# Altium project Project-C_VOLTAGE.PrjPCB (part 5 of 6)
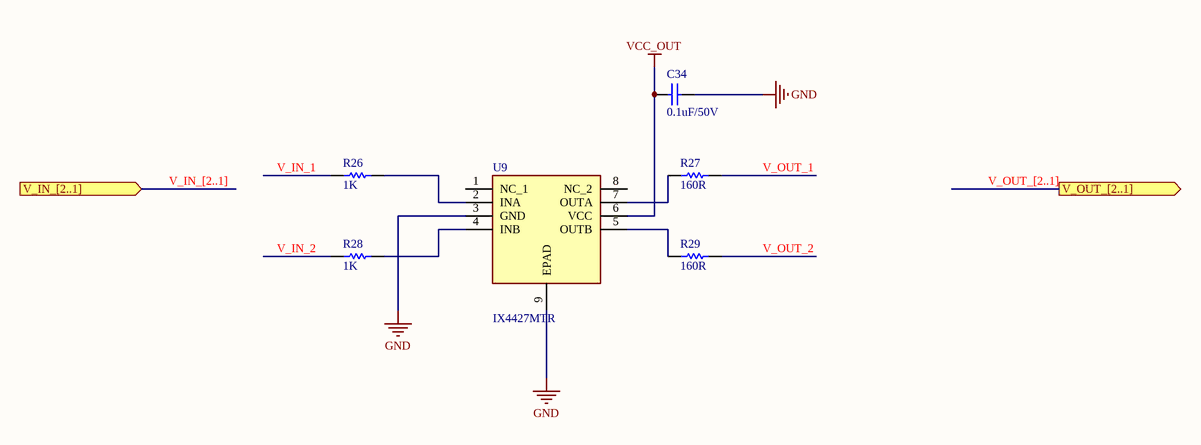
[diagram p12: VoltageAmplifier.SchDoc]

## Nets that join several sheets (continued)
GPIO_47: F3/IO (P1_F3_IO.41), U_VoltageAmplifier_1xFPGA3/U_VoltageAmplifier24 (R28_U_VoltageAmplifier_1xFPGA3_U_VoltageAmplifier24.1)
GPIO_47: F4/IO (P1_F4_IO.41), U_VoltageAmplifier_1xFPGA4/U_VoltageAmplifier24 (R28_U_VoltageAmplifier_1xFPGA4_U_VoltageAmplifier24.1)
GPIO_48: F1/IO (P1_F1_IO.43), U_VoltageAmplifier_1xFPGA1/U_VoltageAmplifier25 (R26_U_VoltageAmplifier_1xFPGA1_U_VoltageAmplifier25.1)
GPIO_48: F2/IO (P1_F2_IO.43), U_VoltageAmplifier_1xFPGA2/U_VoltageAmplifier25 (R26_U_VoltageAmplifier_1xFPGA2_U_VoltageAmplifier25.1)
GPIO_48: F3/IO (P1_F3_IO.43), U_VoltageAmplifier_1xFPGA3/U_VoltageAmplifier25 (R26_U_VoltageAmplifier_1xFPGA3_U_VoltageAmplifier25.1)
GPIO_48: F4/IO (P1_F4_IO.43), U_VoltageAmplifier_1xFPGA4/U_VoltageAmplifier25 (R26_U_VoltageAmplifier_1xFPGA4_U_VoltageAmplifier25.1)
GPIO_49: F1/IO (P1_F1_IO.44), U_VoltageAmplifier_1xFPGA1/U_VoltageAmplifier25 (R28_U_VoltageAmplifier_1xFPGA1_U_VoltageAmplifier25.1)
GPIO_49: F2/IO (P1_F2_IO.44), U_VoltageAmplifier_1xFPGA2/U_VoltageAmplifier25 (R28_U_VoltageAmplifier_1xFPGA2_U_VoltageAmplifier25.1)
GPIO_49: F3/IO (P1_F3_IO.44), U_VoltageAmplifier_1xFPGA3/U_VoltageAmplifier25 (R28_U_VoltageAmplifier_1xFPGA3_U_VoltageAmplifier25.1)
GPIO_49: F4/IO (P1_F4_IO.44), U_VoltageAmplifier_1xFPGA4/U_VoltageAmplifier25 (R28_U_VoltageAmplifier_1xFPGA4_U_VoltageAmplifier25.1)
GPIO_50: F1/IO (P1_F1_IO.52), U_VoltageAmplifier_1xFPGA1/U_VoltageAmplifier26 (R26_U_VoltageAmplifier_1xFPGA1_U_VoltageAmplifier26.1)
GPIO_50: F2/IO (P1_F2_IO.52), U_VoltageAmplifier_1xFPGA2/U_VoltageAmplifier26 (R26_U_VoltageAmplifier_1xFPGA2_U_VoltageAmplifier26.1)
GPIO_50: F3/IO (P1_F3_IO.52), U_VoltageAmplifier_1xFPGA3/U_VoltageAmplifier26 (R26_U_VoltageAmplifier_1xFPGA3_U_VoltageAmplifier26.1)
GPIO_50: F4/IO (P1_F4_IO.52), U_VoltageAmplifier_1xFPGA4/U_VoltageAmplifier26 (R26_U_VoltageAmplifier_1xFPGA4_U_VoltageAmplifier26.1)
GPIO_51: F1/IO (P1_F1_IO.46), U_VoltageAmplifier_1xFPGA1/U_VoltageAmplifier26 (R28_U_VoltageAmplifier_1xFPGA1_U_VoltageAmplifier26.1)
GPIO_51: F2/IO (P1_F2_IO.46), U_VoltageAmplifier_1xFPGA2/U_VoltageAmplifier26 (R28_U_VoltageAmplifier_1xFPGA2_U_VoltageAmplifier26.1)
GPIO_51: F3/IO (P1_F3_IO.46), U_VoltageAmplifier_1xFPGA3/U_VoltageAmplifier26 (R28_U_VoltageAmplifier_1xFPGA3_U_VoltageAmplifier26.1)
GPIO_51: F4/IO (P1_F4_IO.46), U_VoltageAmplifier_1xFPGA4/U_VoltageAmplifier26 (R28_U_VoltageAmplifier_1xFPGA4_U_VoltageAmplifier26.1)
GPIO_52: F1/IO (P1_F1_IO.47), U_VoltageAmplifier_1xFPGA1/U_VoltageAmplifier27 (R26_U_VoltageAmplifier_1xFPGA1_U_VoltageAmplifier27.1)
GPIO_52: F2/IO (P1_F2_IO.47), U_VoltageAmplifier_1xFPGA2/U_VoltageAmplifier27 (R26_U_VoltageAmplifier_1xFPGA2_U_VoltageAmplifier27.1)
GPIO_52: F3/IO (P1_F3_IO.47), U_VoltageAmplifier_1xFPGA3/U_VoltageAmplifier27 (R26_U_VoltageAmplifier_1xFPGA3_U_VoltageAmplifier27.1)
GPIO_52: F4/IO (P1_F4_IO.47), U_VoltageAmplifier_1xFPGA4/U_VoltageAmplifier27 (R26_U_VoltageAmplifier_1xFPGA4_U_VoltageAmplifier27.1)
GPIO_53: F1/IO (P1_F1_IO.50), U_VoltageAmplifier_1xFPGA1/U_VoltageAmplifier27 (R28_U_VoltageAmplifier_1xFPGA1_U_VoltageAmplifier27.1)
GPIO_53: F2/IO (P1_F2_IO.50), U_VoltageAmplifier_1xFPGA2/U_VoltageAmplifier27 (R28_U_VoltageAmplifier_1xFPGA2_U_VoltageAmplifier27.1)
GPIO_53: F3/IO (P1_F3_IO.50), U_VoltageAmplifier_1xFPGA3/U_VoltageAmplifier27 (R28_U_VoltageAmplifier_1xFPGA3_U_VoltageAmplifier27.1)
GPIO_53: F4/IO (P1_F4_IO.50), U_VoltageAmplifier_1xFPGA4/U_VoltageAmplifier27 (R28_U_VoltageAmplifier_1xFPGA4_U_VoltageAmplifier27.1)
GPIO_54: F1/IO (P1_F1_IO.57), U_VoltageAmplifier_1xFPGA1/U_VoltageAmplifier28 (R26_U_VoltageAmplifier_1xFPGA1_U_VoltageAmplifier28.1)
GPIO_54: F2/IO (P1_F2_IO.57), U_VoltageAmplifier_1xFPGA2/U_VoltageAmplifier28 (R26_U_VoltageAmplifier_1xFPGA2_U_VoltageAmplifier28.1)
GPIO_54: F3/IO (P1_F3_IO.57), U_VoltageAmplifier_1xFPGA3/U_VoltageAmplifier28 (R26_U_VoltageAmplifier_1xFPGA3_U_VoltageAmplifier28.1)
GPIO_54: F4/IO (P1_F4_IO.57), U_VoltageAmplifier_1xFPGA4/U_VoltageAmplifier28 (R26_U_VoltageAmplifier_1xFPGA4_U_VoltageAmplifier28.1)
GPIO_55: F1/IO (P1_F1_IO.54), U_VoltageAmplifier_1xFPGA1/U_VoltageAmplifier28 (R28_U_VoltageAmplifier_1xFPGA1_U_VoltageAmplifier28.1)
GPIO_55: F2/IO (P1_F2_IO.54), U_VoltageAmplifier_1xFPGA2/U_VoltageAmplifier28 (R28_U_VoltageAmplifier_1xFPGA2_U_VoltageAmplifier28.1)
GPIO_55: F3/IO (P1_F3_IO.54), U_VoltageAmplifier_1xFPGA3/U_VoltageAmplifier28 (R28_U_VoltageAmplifier_1xFPGA3_U_VoltageAmplifier28.1)
GPIO_55: F4/IO (P1_F4_IO.54), U_VoltageAmplifier_1xFPGA4/U_VoltageAmplifier28 (R28_U_VoltageAmplifier_1xFPGA4_U_VoltageAmplifier28.1)
GPIO_56: F1/IO (P1_F1_IO.55), U_VoltageAmplifier_1xFPGA1/U_VoltageAmplifier29 (R26_U_VoltageAmplifier_1xFPGA1_U_VoltageAmplifier29.1)
GPIO_56: F2/IO (P1_F2_IO.55), U_VoltageAmplifier_1xFPGA2/U_VoltageAmplifier29 (R26_U_VoltageAmplifier_1xFPGA2_U_VoltageAmplifier29.1)
GPIO_56: F3/IO (P1_F3_IO.55), U_VoltageAmplifier_1xFPGA3/U_VoltageAmplifier29 (R26_U_VoltageAmplifier_1xFPGA3_U_VoltageAmplifier29.1)
GPIO_56: F4/IO (P1_F4_IO.55), U_VoltageAmplifier_1xFPGA4/U_VoltageAmplifier29 (R26_U_VoltageAmplifier_1xFPGA4_U_VoltageAmplifier29.1)
GPIO_57: F1/IO (P1_F1_IO.56), U_VoltageAmplifier_1xFPGA1/U_VoltageAmplifier29 (R28_U_VoltageAmplifier_1xFPGA1_U_VoltageAmplifier29.1)
GPIO_57: F2/IO (P1_F2_IO.56), U_VoltageAmplifier_1xFPGA2/U_VoltageAmplifier29 (R28_U_VoltageAmplifier_1xFPGA2_U_VoltageAmplifier29.1)
GPIO_57: F3/IO (P1_F3_IO.56), U_VoltageAmplifier_1xFPGA3/U_VoltageAmplifier29 (R28_U_VoltageAmplifier_1xFPGA3_U_VoltageAmplifier29.1)
GPIO_57: F4/IO (P1_F4_IO.56), U_VoltageAmplifier_1xFPGA4/U_VoltageAmplifier29 (R28_U_VoltageAmplifier_1xFPGA4_U_VoltageAmplifier29.1)
GPIO_58: F1/IO (P1_F1_IO.62), U_VoltageAmplifier_1xFPGA1/U_VoltageAmplifier30 (R26_U_VoltageAmplifier_1xFPGA1_U_VoltageAmplifier30.1)
GPIO_58: F2/IO (P1_F2_IO.62), U_VoltageAmplifier_1xFPGA2/U_VoltageAmplifier30 (R26_U_VoltageAmplifier_1xFPGA2_U_VoltageAmplifier30.1)
GPIO_58: F3/IO (P1_F3_IO.62), U_VoltageAmplifier_1xFPGA3/U_VoltageAmplifier30 (R26_U_VoltageAmplifier_1xFPGA3_U_VoltageAmplifier30.1)
GPIO_58: F4/IO (P1_F4_IO.62), U_VoltageAmplifier_1xFPGA4/U_VoltageAmplifier30 (R26_U_VoltageAmplifier_1xFPGA4_U_VoltageAmplifier30.1)
GPIO_59: F1/IO (P1_F1_IO.58), U_VoltageAmplifier_1xFPGA1/U_VoltageAmplifier30 (R28_U_VoltageAmplifier_1xFPGA1_U_VoltageAmplifier30.1)
GPIO_59: F2/IO (P1_F2_IO.58), U_VoltageAmplifier_1xFPGA2/U_VoltageAmplifier30 (R28_U_VoltageAmplifier_1xFPGA2_U_VoltageAmplifier30.1)
GPIO_59: F3/IO (P1_F3_IO.58), U_VoltageAmplifier_1xFPGA3/U_VoltageAmplifier30 (R28_U_VoltageAmplifier_1xFPGA3_U_VoltageAmplifier30.1)
GPIO_59: F4/IO (P1_F4_IO.58), U_VoltageAmplifier_1xFPGA4/U_VoltageAmplifier30 (R28_U_VoltageAmplifier_1xFPGA4_U_VoltageAmplifier30.1)
GPIO_60: F1/IO (P1_F1_IO.59), U_VoltageAmplifier_1xFPGA1/U_VoltageAmplifier31 (R26_U_VoltageAmplifier_1xFPGA1_U_VoltageAmplifier31.1)
GPIO_60: F2/IO (P1_F2_IO.59), U_VoltageAmplifier_1xFPGA2/U_VoltageAmplifier31 (R26_U_VoltageAmplifier_1xFPGA2_U_VoltageAmplifier31.1)
GPIO_60: F3/IO (P1_F3_IO.59), U_VoltageAmplifier_1xFPGA3/U_VoltageAmplifier31 (R26_U_VoltageAmplifier_1xFPGA3_U_VoltageAmplifier31.1)
GPIO_60: F4/IO (P1_F4_IO.59), U_VoltageAmplifier_1xFPGA4/U_VoltageAmplifier31 (R26_U_VoltageAmplifier_1xFPGA4_U_VoltageAmplifier31.1)
GPIO_61: F1/IO (P1_F1_IO.60), U_VoltageAmplifier_1xFPGA1/U_VoltageAmplifier31 (R28_U_VoltageAmplifier_1xFPGA1_U_VoltageAmplifier31.1)
GPIO_61: F2/IO (P1_F2_IO.60), U_VoltageAmplifier_1xFPGA2/U_VoltageAmplifier31 (R28_U_VoltageAmplifier_1xFPGA2_U_VoltageAmplifier31.1)
GPIO_61: F3/IO (P1_F3_IO.60), U_VoltageAmplifier_1xFPGA3/U_VoltageAmplifier31 (R28_U_VoltageAmplifier_1xFPGA3_U_VoltageAmplifier31.1)
GPIO_61: F4/IO (P1_F4_IO.60), U_VoltageAmplifier_1xFPGA4/U_VoltageAmplifier31 (R28_U_VoltageAmplifier_1xFPGA4_U_VoltageAmplifier31.1)
GPIO_62: F1/IO (P1_F1_IO.69), U_VoltageAmplifier_1xFPGA1/U_VoltageAmplifier32 (R26_U_VoltageAmplifier_1xFPGA1_U_VoltageAmplifier32.1)
GPIO_62: F2/IO (P1_F2_IO.69), U_VoltageAmplifier_1xFPGA2/U_VoltageAmplifier32 (R26_U_VoltageAmplifier_1xFPGA2_U_VoltageAmplifier32.1)
GPIO_62: F3/IO (P1_F3_IO.69), U_VoltageAmplifier_1xFPGA3/U_VoltageAmplifier32 (R26_U_VoltageAmplifier_1xFPGA3_U_VoltageAmplifier32.1)
GPIO_62: F4/IO (P1_F4_IO.69), U_VoltageAmplifier_1xFPGA4/U_VoltageAmplifier32 (R26_U_VoltageAmplifier_1xFPGA4_U_VoltageAmplifier32.1)
GPIO_63: F1/IO (P1_F1_IO.64), U_VoltageAmplifier_1xFPGA1/U_VoltageAmplifier32 (R28_U_VoltageAmplifier_1xFPGA1_U_VoltageAmplifier32.1)
GPIO_63: F2/IO (P1_F2_IO.64), U_VoltageAmplifier_1xFPGA2/U_VoltageAmplifier32 (R28_U_VoltageAmplifier_1xFPGA2_U_VoltageAmplifier32.1)
GPIO_63: F3/IO (P1_F3_IO.64), U_VoltageAmplifier_1xFPGA3/U_VoltageAmplifier32 (R28_U_VoltageAmplifier_1xFPGA3_U_VoltageAmplifier32.1)
GPIO_63: F4/IO (P1_F4_IO.64), U_VoltageAmplifier_1xFPGA4/U_VoltageAmplifier32 (R28_U_VoltageAmplifier_1xFPGA4_U_VoltageAmplifier32.1)
GPIO_64: F1/IO (P1_F1_IO.65), U_VoltageAmplifier_1xFPGA1/U_VoltageAmplifier33 (R26_U_VoltageAmplifier_1xFPGA1_U_VoltageAmplifier33.1)
GPIO_64: F2/IO (P1_F2_IO.65), U_VoltageAmplifier_1xFPGA2/U_VoltageAmplifier33 (R26_U_VoltageAmplifier_1xFPGA2_U_VoltageAmplifier33.1)
GPIO_64: F3/IO (P1_F3_IO.65), U_VoltageAmplifier_1xFPGA3/U_VoltageAmplifier33 (R26_U_VoltageAmplifier_1xFPGA3_U_VoltageAmplifier33.1)
GPIO_64: F4/IO (P1_F4_IO.65), U_VoltageAmplifier_1xFPGA4/U_VoltageAmplifier33 (R26_U_VoltageAmplifier_1xFPGA4_U_VoltageAmplifier33.1)
GPIO_65: F1/IO (P1_F1_IO.66), U_VoltageAmplifier_1xFPGA1/U_VoltageAmplifier33 (R28_U_VoltageAmplifier_1xFPGA1_U_VoltageAmplifier33.1)
GPIO_65: F2/IO (P1_F2_IO.66), U_VoltageAmplifier_1xFPGA2/U_VoltageAmplifier33 (R28_U_VoltageAmplifier_1xFPGA2_U_VoltageAmplifier33.1)
GPIO_65: F3/IO (P1_F3_IO.66), U_VoltageAmplifier_1xFPGA3/U_VoltageAmplifier33 (R28_U_VoltageAmplifier_1xFPGA3_U_VoltageAmplifier33.1)
GPIO_65: F4/IO (P1_F4_IO.66), U_VoltageAmplifier_1xFPGA4/U_VoltageAmplifier33 (R28_U_VoltageAmplifier_1xFPGA4_U_VoltageAmplifier33.1)
GPIO_66: F1/IO (P1_F1_IO.76), U_VoltageAmplifier_1xFPGA1/U_VoltageAmplifier34 (R26_U_VoltageAmplifier_1xFPGA1_U_VoltageAmplifier34.1)
GPIO_66: F2/IO (P1_F2_IO.76), U_VoltageAmplifier_1xFPGA2/U_VoltageAmplifier34 (R26_U_VoltageAmplifier_1xFPGA2_U_VoltageAmplifier34.1)
GPIO_66: F3/IO (P1_F3_IO.76), U_VoltageAmplifier_1xFPGA3/U_VoltageAmplifier34 (R26_U_VoltageAmplifier_1xFPGA3_U_VoltageAmplifier34.1)
GPIO_66: F4/IO (P1_F4_IO.76), U_VoltageAmplifier_1xFPGA4/U_VoltageAmplifier34 (R26_U_VoltageAmplifier_1xFPGA4_U_VoltageAmplifier34.1)
GPIO_67: F1/IO (P1_F1_IO.70), U_VoltageAmplifier_1xFPGA1/U_VoltageAmplifier34 (R28_U_VoltageAmplifier_1xFPGA1_U_VoltageAmplifier34.1)
GPIO_67: F2/IO (P1_F2_IO.70), U_VoltageAmplifier_1xFPGA2/U_VoltageAmplifier34 (R28_U_VoltageAmplifier_1xFPGA2_U_VoltageAmplifier34.1)
GPIO_67: F3/IO (P1_F3_IO.70), U_VoltageAmplifier_1xFPGA3/U_VoltageAmplifier34 (R28_U_VoltageAmplifier_1xFPGA3_U_VoltageAmplifier34.1)
GPIO_67: F4/IO (P1_F4_IO.70), U_VoltageAmplifier_1xFPGA4/U_VoltageAmplifier34 (R28_U_VoltageAmplifier_1xFPGA4_U_VoltageAmplifier34.1)
GPIO_68: F1/IO (P1_F1_IO.74), U_VoltageAmplifier_1xFPGA1/U_VoltageAmplifier35 (R26_U_VoltageAmplifier_1xFPGA1_U_VoltageAmplifier35.1)
GPIO_68: F2/IO (P1_F2_IO.74), U_VoltageAmplifier_1xFPGA2/U_VoltageAmplifier35 (R26_U_VoltageAmplifier_1xFPGA2_U_VoltageAmplifier35.1)
GPIO_68: F3/IO (P1_F3_IO.74), U_VoltageAmplifier_1xFPGA3/U_VoltageAmplifier35 (R26_U_VoltageAmplifier_1xFPGA3_U_VoltageAmplifier35.1)
GPIO_68: F4/IO (P1_F4_IO.74), U_VoltageAmplifier_1xFPGA4/U_VoltageAmplifier35 (R26_U_VoltageAmplifier_1xFPGA4_U_VoltageAmplifier35.1)
GPIO_69: F1/IO (P1_F1_IO.75), U_VoltageAmplifier_1xFPGA1/U_VoltageAmplifier35 (R28_U_VoltageAmplifier_1xFPGA1_U_VoltageAmplifier35.1)
GPIO_69: F2/IO (P1_F2_IO.75), U_VoltageAmplifier_1xFPGA2/U_VoltageAmplifier35 (R28_U_VoltageAmplifier_1xFPGA2_U_VoltageAmplifier35.1)
GPIO_69: F3/IO (P1_F3_IO.75), U_VoltageAmplifier_1xFPGA3/U_VoltageAmplifier35 (R28_U_VoltageAmplifier_1xFPGA3_U_VoltageAmplifier35.1)
GPIO_69: F4/IO (P1_F4_IO.75), U_VoltageAmplifier_1xFPGA4/U_VoltageAmplifier35 (R28_U_VoltageAmplifier_1xFPGA4_U_VoltageAmplifier35.1)
GPIO_70: F1/IO (P1_F1_IO.81), U_VoltageAmplifier_1xFPGA1/U_VoltageAmplifier36 (R26_U_VoltageAmplifier_1xFPGA1_U_VoltageAmplifier36.1)
GPIO_70: F2/IO (P1_F2_IO.81), U_VoltageAmplifier_1xFPGA2/U_VoltageAmplifier36 (R26_U_VoltageAmplifier_1xFPGA2_U_VoltageAmplifier36.1)
GPIO_70: F3/IO (P1_F3_IO.81), U_VoltageAmplifier_1xFPGA3/U_VoltageAmplifier36 (R26_U_VoltageAmplifier_1xFPGA3_U_VoltageAmplifier36.1)
GPIO_70: F4/IO (P1_F4_IO.81), U_VoltageAmplifier_1xFPGA4/U_VoltageAmplifier36 (R26_U_VoltageAmplifier_1xFPGA4_U_VoltageAmplifier36.1)
GPIO_71: F1/IO (P1_F1_IO.77), U_VoltageAmplifier_1xFPGA1/U_VoltageAmplifier36 (R28_U_VoltageAmplifier_1xFPGA1_U_VoltageAmplifier36.1)
GPIO_71: F2/IO (P1_F2_IO.77), U_VoltageAmplifier_1xFPGA2/U_VoltageAmplifier36 (R28_U_VoltageAmplifier_1xFPGA2_U_VoltageAmplifier36.1)
GPIO_71: F3/IO (P1_F3_IO.77), U_VoltageAmplifier_1xFPGA3/U_VoltageAmplifier36 (R28_U_VoltageAmplifier_1xFPGA3_U_VoltageAmplifier36.1)
GPIO_71: F4/IO (P1_F4_IO.77), U_VoltageAmplifier_1xFPGA4/U_VoltageAmplifier36 (R28_U_VoltageAmplifier_1xFPGA4_U_VoltageAmplifier36.1)
GPIO_72: F1/IO (P1_F1_IO.78), U_VoltageAmplifier_1xFPGA1/U_VoltageAmplifier37 (R26_U_VoltageAmplifier_1xFPGA1_U_VoltageAmplifier37.1)
GPIO_72: F2/IO (P1_F2_IO.78), U_VoltageAmplifier_1xFPGA2/U_VoltageAmplifier37 (R26_U_VoltageAmplifier_1xFPGA2_U_VoltageAmplifier37.1)
GPIO_72: F3/IO (P1_F3_IO.78), U_VoltageAmplifier_1xFPGA3/U_VoltageAmplifier37 (R26_U_VoltageAmplifier_1xFPGA3_U_VoltageAmplifier37.1)
GPIO_72: F4/IO (P1_F4_IO.78), U_VoltageAmplifier_1xFPGA4/U_VoltageAmplifier37 (R26_U_VoltageAmplifier_1xFPGA4_U_VoltageAmplifier37.1)
GPIO_73: F1/IO (P1_F1_IO.79), U_VoltageAmplifier_1xFPGA1/U_VoltageAmplifier37 (R28_U_VoltageAmplifier_1xFPGA1_U_VoltageAmplifier37.1)
GPIO_73: F2/IO (P1_F2_IO.79), U_VoltageAmplifier_1xFPGA2/U_VoltageAmplifier37 (R28_U_VoltageAmplifier_1xFPGA2_U_VoltageAmplifier37.1)
GPIO_73: F3/IO (P1_F3_IO.79), U_VoltageAmplifier_1xFPGA3/U_VoltageAmplifier37 (R28_U_VoltageAmplifier_1xFPGA3_U_VoltageAmplifier37.1)
GPIO_73: F4/IO (P1_F4_IO.79), U_VoltageAmplifier_1xFPGA4/U_VoltageAmplifier37 (R28_U_VoltageAmplifier_1xFPGA4_U_VoltageAmplifier37.1)
GPIO_74: F1/IO (P1_F1_IO.84), U_VoltageAmplifier_1xFPGA1/U_VoltageAmplifier38 (R26_U_VoltageAmplifier_1xFPGA1_U_VoltageAmplifier38.1)
GPIO_74: F2/IO (P1_F2_IO.84), U_VoltageAmplifier_1xFPGA2/U_VoltageAmplifier38 (R26_U_VoltageAmplifier_1xFPGA2_U_VoltageAmplifier38.1)
GPIO_74: F3/IO (P1_F3_IO.84), U_VoltageAmplifier_1xFPGA3/U_VoltageAmplifier38 (R26_U_VoltageAmplifier_1xFPGA3_U_VoltageAmplifier38.1)
GPIO_74: F4/IO (P1_F4_IO.84), U_VoltageAmplifier_1xFPGA4/U_VoltageAmplifier38 (R26_U_VoltageAmplifier_1xFPGA4_U_VoltageAmplifier38.1)
ID0: TOP_VOLTAGE (R24.1), F1/IO (P1_F1_IO.112)
ID0: TOP_VOLTAGE (R30.2), F2/IO (P1_F2_IO.112)
ID0: TOP_VOLTAGE (R32.1), F3/IO (P1_F3_IO.112)
ID0: TOP_VOLTAGE (R34.2), F4/IO (P1_F4_IO.112)
ID1: TOP_VOLTAGE (R23.1), F1/IO (P1_F1_IO.123)
ID1: TOP_VOLTAGE (R25.1), F2/IO (P1_F2_IO.123)
ID1: TOP_VOLTAGE (R31.2), F3/IO (P1_F3_IO.123)
ID1: TOP_VOLTAGE (R33.2), F4/IO (P1_F4_IO.123)
SCL: F1/IO (P1_F1_IO.97 R14_F1_IO.1), POWER_VOLTAGE (U4.2)
SDA: F1/IO (P1_F1_IO.80 R20_F1_IO.1), POWER_VOLTAGE (U4.3)
TCK: TOP_VOLTAGE (C36.2 P3.1 R12.2 U8.1), F1/IO (P1_F1_IO.18), F2/IO (P1_F2_IO.18), F3/IO (P1_F3_IO.18), F4/IO (P1_F4_IO.18)
TDI: TOP_VOLTAGE (C39.2 P3.9 R10.2 U8.4), F1/IO (P1_F1_IO.19)
TDI: F1/IO (P1_F1_IO.20), F2/IO (P1_F2_IO.19)
TDI: F2/IO (P1_F2_IO.20), F3/IO (P1_F3_IO.19)
TDI: F3/IO (P1_F3_IO.20), F4/IO (P1_F4_IO.19)
TDO: TOP_VOLTAGE (C37.2 P3.3 U8.6), F4/IO (P1_F4_IO.20)
TMS: TOP_VOLTAGE (C38.2 P3.5 R11.2 U8.3), F1/IO (P1_F1_IO.16), F2/IO (P1_F2_IO.16), F3/IO (P1_F3_IO.16), F4/IO (P1_F4_IO.16)
V_OUT1: VoltageHeaders (P_E_1.2), U_VoltageAmplifier_1xFPGA1/U_VoltageAmplifier1 (R27_U_VoltageAmplifier_1xFPGA1_U_VoltageAmplifier1.2)
V_OUT1: VoltageHeaders (P_E_2.2), U_VoltageAmplifier_1xFPGA2/U_VoltageAmplifier1 (R27_U_VoltageAmplifier_1xFPGA2_U_VoltageAmplifier1.2)
V_OUT1: VoltageHeaders (P_E_3.2), U_VoltageAmplifier_1xFPGA3/U_VoltageAmplifier1 (R27_U_VoltageAmplifier_1xFPGA3_U_VoltageAmplifier1.2)
V_OUT1: VoltageHeaders (P_E_4.2), U_VoltageAmplifier_1xFPGA4/U_VoltageAmplifier1 (R27_U_VoltageAmplifier_1xFPGA4_U_VoltageAmplifier1.2)
V_OUT2: VoltageHeaders (P_E_1.4), U_VoltageAmplifier_1xFPGA1/U_VoltageAmplifier1 (R29_U_VoltageAmplifier_1xFPGA1_U_VoltageAmplifier1.2)
V_OUT2: VoltageHeaders (P_E_2.4), U_VoltageAmplifier_1xFPGA2/U_VoltageAmplifier1 (R29_U_VoltageAmplifier_1xFPGA2_U_VoltageAmplifier1.2)
V_OUT2: VoltageHeaders (P_E_4.4), U_VoltageAmplifier_1xFPGA4/U_VoltageAmplifier1 (R29_U_VoltageAmplifier_1xFPGA4_U_VoltageAmplifier1.2)
V_OUT3: VoltageHeaders (P_E_1.3), U_VoltageAmplifier_1xFPGA1/U_VoltageAmplifier2 (R27_U_VoltageAmplifier_1xFPGA1_U_VoltageAmplifier2.2)
V_OUT3: VoltageHeaders (P_E_2.3), U_VoltageAmplifier_1xFPGA2/U_VoltageAmplifier2 (R27_U_VoltageAmplifier_1xFPGA2_U_VoltageAmplifier2.2)
V_OUT4: VoltageHeaders (P_E_1.1), U_VoltageAmplifier_1xFPGA1/U_VoltageAmplifier2 (R29_U_VoltageAmplifier_1xFPGA1_U_VoltageAmplifier2.2)
V_OUT4: VoltageHeaders (P_E_2.1), U_VoltageAmplifier_1xFPGA2/U_VoltageAmplifier2 (R29_U_VoltageAmplifier_1xFPGA2_U_VoltageAmplifier2.2)
V_OUT5: VoltageHeaders (P_E_1.6), U_VoltageAmplifier_1xFPGA1/U_VoltageAmplifier3 (R27_U_VoltageAmplifier_1xFPGA1_U_VoltageAmplifier3.2)
V_OUT5: VoltageHeaders (P_E_2.6), U_VoltageAmplifier_1xFPGA2/U_VoltageAmplifier3 (R27_U_VoltageAmplifier_1xFPGA2_U_VoltageAmplifier3.2)
V_OUT6: VoltageHeaders (P_E_1.8), U_VoltageAmplifier_1xFPGA1/U_VoltageAmplifier3 (R29_U_VoltageAmplifier_1xFPGA1_U_VoltageAmplifier3.2)
V_OUT6: VoltageHeaders (P_E_2.8), U_VoltageAmplifier_1xFPGA2/U_VoltageAmplifier3 (R29_U_VoltageAmplifier_1xFPGA2_U_VoltageAmplifier3.2)
V_OUT7: VoltageHeaders (P_E_1.7), U_VoltageAmplifier_1xFPGA1/U_VoltageAmplifier4 (R27_U_VoltageAmplifier_1xFPGA1_U_VoltageAmplifier4.2)
V_OUT7: VoltageHeaders (P_E_2.7), U_VoltageAmplifier_1xFPGA2/U_VoltageAmplifier4 (R27_U_VoltageAmplifier_1xFPGA2_U_VoltageAmplifier4.2)
V_OUT8: VoltageHeaders (P_E_1.5), U_VoltageAmplifier_1xFPGA1/U_VoltageAmplifier4 (R29_U_VoltageAmplifier_1xFPGA1_U_VoltageAmplifier4.2)
V_OUT8: VoltageHeaders (P_E_2.5), U_VoltageAmplifier_1xFPGA2/U_VoltageAmplifier4 (R29_U_VoltageAmplifier_1xFPGA2_U_VoltageAmplifier4.2)
V_OUT9: VoltageHeaders (P_E_1.10), U_VoltageAmplifier_1xFPGA1/U_VoltageAmplifier5 (R27_U_VoltageAmplifier_1xFPGA1_U_VoltageAmplifier5.2)
V_OUT10: VoltageHeaders (P_E_1.12), U_VoltageAmplifier_1xFPGA1/U_VoltageAmplifier5 (R29_U_VoltageAmplifier_1xFPGA1_U_VoltageAmplifier5.2)
V_OUT10: VoltageHeaders (P_E_2.12), U_VoltageAmplifier_1xFPGA2/U_VoltageAmplifier5 (R29_U_VoltageAmplifier_1xFPGA2_U_VoltageAmplifier5.2)
V_OUT10: VoltageHeaders (P_E_3.12), U_VoltageAmplifier_1xFPGA3/U_VoltageAmplifier5 (R29_U_VoltageAmplifier_1xFPGA3_U_VoltageAmplifier5.2)
V_OUT10: VoltageHeaders (P_E_4.12), U_VoltageAmplifier_1xFPGA4/U_VoltageAmplifier5 (R29_U_VoltageAmplifier_1xFPGA4_U_VoltageAmplifier5.2)
V_OUT11: VoltageHeaders (P_E_1.11), U_VoltageAmplifier_1xFPGA1/U_VoltageAmplifier6 (R27_U_VoltageAmplifier_1xFPGA1_U_VoltageAmplifier6.2)
V_OUT11: VoltageHeaders (P_E_2.11), U_VoltageAmplifier_1xFPGA2/U_VoltageAmplifier6 (R27_U_VoltageAmplifier_1xFPGA2_U_VoltageAmplifier6.2)
V_OUT11: VoltageHeaders (P_E_3.11), U_VoltageAmplifier_1xFPGA3/U_VoltageAmplifier6 (R27_U_VoltageAmplifier_1xFPGA3_U_VoltageAmplifier6.2)
V_OUT11: VoltageHeaders (P_E_4.11), U_VoltageAmplifier_1xFPGA4/U_VoltageAmplifier6 (R27_U_VoltageAmplifier_1xFPGA4_U_VoltageAmplifier6.2)
V_OUT12: VoltageHeaders (P_E_1.9), U_VoltageAmplifier_1xFPGA1/U_VoltageAmplifier6 (R29_U_VoltageAmplifier_1xFPGA1_U_VoltageAmplifier6.2)
V_OUT12: VoltageHeaders (P_E_2.9), U_VoltageAmplifier_1xFPGA2/U_VoltageAmplifier6 (R29_U_VoltageAmplifier_1xFPGA2_U_VoltageAmplifier6.2)
V_OUT12: VoltageHeaders (P_E_3.9), U_VoltageAmplifier_1xFPGA3/U_VoltageAmplifier6 (R29_U_VoltageAmplifier_1xFPGA3_U_VoltageAmplifier6.2)
V_OUT12: VoltageHeaders (P_E_4.9), U_VoltageAmplifier_1xFPGA4/U_VoltageAmplifier6 (R29_U_VoltageAmplifier_1xFPGA4_U_VoltageAmplifier6.2)
V_OUT13: VoltageHeaders (P_E_1.14), U_VoltageAmplifier_1xFPGA1/U_VoltageAmplifier7 (R27_U_VoltageAmplifier_1xFPGA1_U_VoltageAmplifier7.2)
V_OUT13: VoltageHeaders (P_E_2.14), U_VoltageAmplifier_1xFPGA2/U_VoltageAmplifier7 (R27_U_VoltageAmplifier_1xFPGA2_U_VoltageAmplifier7.2)
V_OUT13: VoltageHeaders (P_E_3.14), U_VoltageAmplifier_1xFPGA3/U_VoltageAmplifier7 (R27_U_VoltageAmplifier_1xFPGA3_U_VoltageAmplifier7.2)
V_OUT13: VoltageHeaders (P_E_4.14), U_VoltageAmplifier_1xFPGA4/U_VoltageAmplifier7 (R27_U_VoltageAmplifier_1xFPGA4_U_VoltageAmplifier7.2)
V_OUT14: VoltageHeaders (P_E_1.16), U_VoltageAmplifier_1xFPGA1/U_VoltageAmplifier7 (R29_U_VoltageAmplifier_1xFPGA1_U_VoltageAmplifier7.2)
V_OUT14: VoltageHeaders (P_E_2.16), U_VoltageAmplifier_1xFPGA2/U_VoltageAmplifier7 (R29_U_VoltageAmplifier_1xFPGA2_U_VoltageAmplifier7.2)
V_OUT14: VoltageHeaders (P_E_3.16), U_VoltageAmplifier_1xFPGA3/U_VoltageAmplifier7 (R29_U_VoltageAmplifier_1xFPGA3_U_VoltageAmplifier7.2)
V_OUT14: VoltageHeaders (P_E_4.16), U_VoltageAmplifier_1xFPGA4/U_VoltageAmplifier7 (R29_U_VoltageAmplifier_1xFPGA4_U_VoltageAmplifier7.2)
V_OUT15: VoltageHeaders (P_E_1.15), U_VoltageAmplifier_1xFPGA1/U_VoltageAmplifier8 (R27_U_VoltageAmplifier_1xFPGA1_U_VoltageAmplifier8.2)
V_OUT15: VoltageHeaders (P_E_2.15), U_VoltageAmplifier_1xFPGA2/U_VoltageAmplifier8 (R27_U_VoltageAmplifier_1xFPGA2_U_VoltageAmplifier8.2)
V_OUT15: VoltageHeaders (P_E_3.15), U_VoltageAmplifier_1xFPGA3/U_VoltageAmplifier8 (R27_U_VoltageAmplifier_1xFPGA3_U_VoltageAmplifier8.2)
V_OUT15: VoltageHeaders (P_E_4.15), U_VoltageAmplifier_1xFPGA4/U_VoltageAmplifier8 (R27_U_VoltageAmplifier_1xFPGA4_U_VoltageAmplifier8.2)
V_OUT16: VoltageHeaders (P_E_1.13), U_VoltageAmplifier_1xFPGA1/U_VoltageAmplifier8 (R29_U_VoltageAmplifier_1xFPGA1_U_VoltageAmplifier8.2)
V_OUT16: VoltageHeaders (P_E_2.13), U_VoltageAmplifier_1xFPGA2/U_VoltageAmplifier8 (R29_U_VoltageAmplifier_1xFPGA2_U_VoltageAmplifier8.2)
V_OUT16: VoltageHeaders (P_E_3.13), U_VoltageAmplifier_1xFPGA3/U_VoltageAmplifier8 (R29_U_VoltageAmplifier_1xFPGA3_U_VoltageAmplifier8.2)
V_OUT16: VoltageHeaders (P_E_4.13), U_VoltageAmplifier_1xFPGA4/U_VoltageAmplifier8 (R29_U_VoltageAmplifier_1xFPGA4_U_VoltageAmplifier8.2)
V_OUT17: VoltageHeaders (P_E_1.18), U_VoltageAmplifier_1xFPGA1/U_VoltageAmplifier9 (R27_U_VoltageAmplifier_1xFPGA1_U_VoltageAmplifier9.2)
V_OUT17: VoltageHeaders (P_E_2.18), U_VoltageAmplifier_1xFPGA2/U_VoltageAmplifier9 (R27_U_VoltageAmplifier_1xFPGA2_U_VoltageAmplifier9.2)
V_OUT17: VoltageHeaders (P_E_4.18), U_VoltageAmplifier_1xFPGA4/U_VoltageAmplifier9 (R27_U_VoltageAmplifier_1xFPGA4_U_VoltageAmplifier9.2)
V_OUT18: VoltageHeaders (P_E_1.20), U_VoltageAmplifier_1xFPGA1/U_VoltageAmplifier9 (R29_U_VoltageAmplifier_1xFPGA1_U_VoltageAmplifier9.2)
V_OUT18: VoltageHeaders (P_E_2.20), U_VoltageAmplifier_1xFPGA2/U_VoltageAmplifier9 (R29_U_VoltageAmplifier_1xFPGA2_U_VoltageAmplifier9.2)
V_OUT18: VoltageHeaders (P_E_4.20), U_VoltageAmplifier_1xFPGA4/U_VoltageAmplifier9 (R29_U_VoltageAmplifier_1xFPGA4_U_VoltageAmplifier9.2)
V_OUT19: VoltageHeaders (P_E_1.19), U_VoltageAmplifier_1xFPGA1/U_VoltageAmplifier10 (R27_U_VoltageAmplifier_1xFPGA1_U_VoltageAmplifier10.2)
V_OUT19: VoltageHeaders (P_E_2.19), U_VoltageAmplifier_1xFPGA2/U_VoltageAmplifier10 (R27_U_VoltageAmplifier_1xFPGA2_U_VoltageAmplifier10.2)
V_OUT19: VoltageHeaders (P_E_4.19), U_VoltageAmplifier_1xFPGA4/U_VoltageAmplifier10 (R27_U_VoltageAmplifier_1xFPGA4_U_VoltageAmplifier10.2)
V_OUT20: VoltageHeaders (P_E_1.17), U_VoltageAmplifier_1xFPGA1/U_VoltageAmplifier10 (R29_U_VoltageAmplifier_1xFPGA1_U_VoltageAmplifier10.2)
V_OUT20: VoltageHeaders (P_E_2.17), U_VoltageAmplifier_1xFPGA2/U_VoltageAmplifier10 (R29_U_VoltageAmplifier_1xFPGA2_U_VoltageAmplifier10.2)
V_OUT20: VoltageHeaders (P_E_4.17), U_VoltageAmplifier_1xFPGA4/U_VoltageAmplifier10 (R29_U_VoltageAmplifier_1xFPGA4_U_VoltageAmplifier10.2)
V_OUT21: VoltageHeaders (P_E_1.22), U_VoltageAmplifier_1xFPGA1/U_VoltageAmplifier11 (R27_U_VoltageAmplifier_1xFPGA1_U_VoltageAmplifier11.2)
V_OUT21: VoltageHeaders (P_E_2.22), U_VoltageAmplifier_1xFPGA2/U_VoltageAmplifier11 (R27_U_VoltageAmplifier_1xFPGA2_U_VoltageAmplifier11.2)
V_OUT21: VoltageHeaders (P_E_4.22), U_VoltageAmplifier_1xFPGA4/U_VoltageAmplifier11 (R27_U_VoltageAmplifier_1xFPGA4_U_VoltageAmplifier11.2)
V_OUT22: VoltageHeaders (P_E_1.24), U_VoltageAmplifier_1xFPGA1/U_VoltageAmplifier11 (R29_U_VoltageAmplifier_1xFPGA1_U_VoltageAmplifier11.2)
V_OUT22: VoltageHeaders (P_E_2.24), U_VoltageAmplifier_1xFPGA2/U_VoltageAmplifier11 (R29_U_VoltageAmplifier_1xFPGA2_U_VoltageAmplifier11.2)
V_OUT22: VoltageHeaders (P_E_4.24), U_VoltageAmplifier_1xFPGA4/U_VoltageAmplifier11 (R29_U_VoltageAmplifier_1xFPGA4_U_VoltageAmplifier11.2)
V_OUT23: VoltageHeaders (P_E_1.23), U_VoltageAmplifier_1xFPGA1/U_VoltageAmplifier12 (R27_U_VoltageAmplifier_1xFPGA1_U_VoltageAmplifier12.2)
V_OUT23: VoltageHeaders (P_E_2.23), U_VoltageAmplifier_1xFPGA2/U_VoltageAmplifier12 (R27_U_VoltageAmplifier_1xFPGA2_U_VoltageAmplifier12.2)
V_OUT23: VoltageHeaders (P_E_4.23), U_VoltageAmplifier_1xFPGA4/U_VoltageAmplifier12 (R27_U_VoltageAmplifier_1xFPGA4_U_VoltageAmplifier12.2)
V_OUT24: VoltageHeaders (P_E_1.21), U_VoltageAmplifier_1xFPGA1/U_VoltageAmplifier12 (R29_U_VoltageAmplifier_1xFPGA1_U_VoltageAmplifier12.2)
V_OUT24: VoltageHeaders (P_E_2.21), U_VoltageAmplifier_1xFPGA2/U_VoltageAmplifier12 (R29_U_VoltageAmplifier_1xFPGA2_U_VoltageAmplifier12.2)
V_OUT24: VoltageHeaders (P_E_4.21), U_VoltageAmplifier_1xFPGA4/U_VoltageAmplifier12 (R29_U_VoltageAmplifier_1xFPGA4_U_VoltageAmplifier12.2)
V_OUT25: VoltageHeaders (P_E_1.26), U_VoltageAmplifier_1xFPGA1/U_VoltageAmplifier13 (R27_U_VoltageAmplifier_1xFPGA1_U_VoltageAmplifier13.2)
V_OUT25: VoltageHeaders (P_E_4.26), U_VoltageAmplifier_1xFPGA4/U_VoltageAmplifier13 (R27_U_VoltageAmplifier_1xFPGA4_U_VoltageAmplifier13.2)
V_OUT26: VoltageHeaders (P_E_1.28), U_VoltageAmplifier_1xFPGA1/U_VoltageAmplifier13 (R29_U_VoltageAmplifier_1xFPGA1_U_VoltageAmplifier13.2)
V_OUT27: VoltageHeaders (P_E_1.27), U_VoltageAmplifier_1xFPGA1/U_VoltageAmplifier14 (R27_U_VoltageAmplifier_1xFPGA1_U_VoltageAmplifier14.2)
V_OUT28: VoltageHeaders (P_E_1.25), U_VoltageAmplifier_1xFPGA1/U_VoltageAmplifier14 (R29_U_VoltageAmplifier_1xFPGA1_U_VoltageAmplifier14.2)
V_OUT29: VoltageHeaders (P_E_1.30), U_VoltageAmplifier_1xFPGA1/U_VoltageAmplifier15 (R27_U_VoltageAmplifier_1xFPGA1_U_VoltageAmplifier15.2)
V_OUT30: VoltageHeaders (P_E_1.32), U_VoltageAmplifier_1xFPGA1/U_VoltageAmplifier15 (R29_U_VoltageAmplifier_1xFPGA1_U_VoltageAmplifier15.2)
V_OUT31: VoltageHeaders (P_E_1.31), U_VoltageAmplifier_1xFPGA1/U_VoltageAmplifier16 (R27_U_VoltageAmplifier_1xFPGA1_U_VoltageAmplifier16.2)
V_OUT32: VoltageHeaders (P_E_1.29), U_VoltageAmplifier_1xFPGA1/U_VoltageAmplifier16 (R29_U_VoltageAmplifier_1xFPGA1_U_VoltageAmplifier16.2)
V_OUT33: VoltageHeaders (P_E_1.34), U_VoltageAmplifier_1xFPGA1/U_VoltageAmplifier17 (R27_U_VoltageAmplifier_1xFPGA1_U_VoltageAmplifier17.2)
V_OUT34: VoltageHeaders (P_E_1.36), U_VoltageAmplifier_1xFPGA1/U_VoltageAmplifier17 (R29_U_VoltageAmplifier_1xFPGA1_U_VoltageAmplifier17.2)
V_OUT35: VoltageHeaders (P_E_1.35), U_VoltageAmplifier_1xFPGA1/U_VoltageAmplifier18 (R27_U_VoltageAmplifier_1xFPGA1_U_VoltageAmplifier18.2)
V_OUT36: VoltageHeaders (P_E_1.33), U_VoltageAmplifier_1xFPGA1/U_VoltageAmplifier18 (R29_U_VoltageAmplifier_1xFPGA1_U_VoltageAmplifier18.2)
V_OUT37: VoltageHeaders (P_E_1.38), U_VoltageAmplifier_1xFPGA1/U_VoltageAmplifier19 (R27_U_VoltageAmplifier_1xFPGA1_U_VoltageAmplifier19.2)
V_OUT38: VoltageHeaders (P_E_1.37), U_VoltageAmplifier_1xFPGA1/U_VoltageAmplifier19 (R29_U_VoltageAmplifier_1xFPGA1_U_VoltageAmplifier19.2)
V_OUT39: VoltageHeaders (P_O_1.3), U_VoltageAmplifier_1xFPGA1/U_VoltageAmplifier20 (R27_U_VoltageAmplifier_1xFPGA1_U_VoltageAmplifier20.2)
V_OUT40: VoltageHeaders (P_O_1.1), U_VoltageAmplifier_1xFPGA1/U_VoltageAmplifier20 (R29_U_VoltageAmplifier_1xFPGA1_U_VoltageAmplifier20.2)
V_OUT41: VoltageHeaders (P_O_1.2), U_VoltageAmplifier_1xFPGA1/U_VoltageAmplifier21 (R27_U_VoltageAmplifier_1xFPGA1_U_VoltageAmplifier21.2)
V_OUT42: VoltageHeaders (P_O_1.4), U_VoltageAmplifier_1xFPGA1/U_VoltageAmplifier21 (R29_U_VoltageAmplifier_1xFPGA1_U_VoltageAmplifier21.2)
V_OUT43: VoltageHeaders (P_O_1.7), U_VoltageAmplifier_1xFPGA1/U_VoltageAmplifier22 (R27_U_VoltageAmplifier_1xFPGA1_U_VoltageAmplifier22.2)
V_OUT44: VoltageHeaders (P_O_1.5), U_VoltageAmplifier_1xFPGA1/U_VoltageAmplifier22 (R29_U_VoltageAmplifier_1xFPGA1_U_VoltageAmplifier22.2)
V_OUT45: VoltageHeaders (P_O_1.6), U_VoltageAmplifier_1xFPGA1/U_VoltageAmplifier23 (R27_U_VoltageAmplifier_1xFPGA1_U_VoltageAmplifier23.2)
V_OUT46: VoltageHeaders (P_O_1.8), U_VoltageAmplifier_1xFPGA1/U_VoltageAmplifier23 (R29_U_VoltageAmplifier_1xFPGA1_U_VoltageAmplifier23.2)
V_OUT47: VoltageHeaders (P_O_1.11), U_VoltageAmplifier_1xFPGA1/U_VoltageAmplifier24 (R27_U_VoltageAmplifier_1xFPGA1_U_VoltageAmplifier24.2)
V_OUT48: VoltageHeaders (P_O_1.9), U_VoltageAmplifier_1xFPGA1/U_VoltageAmplifier24 (R29_U_VoltageAmplifier_1xFPGA1_U_VoltageAmplifier24.2)
V_OUT49: VoltageHeaders (P_O_1.10), U_VoltageAmplifier_1xFPGA1/U_VoltageAmplifier25 (R27_U_VoltageAmplifier_1xFPGA1_U_VoltageAmplifier25.2)
V_OUT50: VoltageHeaders (P_O_1.12), U_VoltageAmplifier_1xFPGA1/U_VoltageAmplifier25 (R29_U_VoltageAmplifier_1xFPGA1_U_VoltageAmplifier25.2)
V_OUT51: VoltageHeaders (P_O_1.15), U_VoltageAmplifier_1xFPGA1/U_VoltageAmplifier26 (R27_U_VoltageAmplifier_1xFPGA1_U_VoltageAmplifier26.2)
V_OUT52: VoltageHeaders (P_O_1.13), U_VoltageAmplifier_1xFPGA1/U_VoltageAmplifier26 (R29_U_VoltageAmplifier_1xFPGA1_U_VoltageAmplifier26.2)
V_OUT53: VoltageHeaders (P_O_1.14), U_VoltageAmplifier_1xFPGA1/U_VoltageAmplifier27 (R27_U_VoltageAmplifier_1xFPGA1_U_VoltageAmplifier27.2)
V_OUT54: VoltageHeaders (P_O_1.16), U_VoltageAmplifier_1xFPGA1/U_VoltageAmplifier27 (R29_U_VoltageAmplifier_1xFPGA1_U_VoltageAmplifier27.2)
V_OUT55: VoltageHeaders (P_O_1.19), U_VoltageAmplifier_1xFPGA1/U_VoltageAmplifier28 (R27_U_VoltageAmplifier_1xFPGA1_U_VoltageAmplifier28.2)
V_OUT56: VoltageHeaders (P_O_1.17), U_VoltageAmplifier_1xFPGA1/U_VoltageAmplifier28 (R29_U_VoltageAmplifier_1xFPGA1_U_VoltageAmplifier28.2)
V_OUT57: VoltageHeaders (P_O_1.18), U_VoltageAmplifier_1xFPGA1/U_VoltageAmplifier29 (R27_U_VoltageAmplifier_1xFPGA1_U_VoltageAmplifier29.2)
V_OUT58: VoltageHeaders (P_O_1.20), U_VoltageAmplifier_1xFPGA1/U_VoltageAmplifier29 (R29_U_VoltageAmplifier_1xFPGA1_U_VoltageAmplifier29.2)
V_OUT59: VoltageHeaders (P_O_1.23), U_VoltageAmplifier_1xFPGA1/U_VoltageAmplifier30 (R27_U_VoltageAmplifier_1xFPGA1_U_VoltageAmplifier30.2)
V_OUT60: VoltageHeaders (P_O_1.21), U_VoltageAmplifier_1xFPGA1/U_VoltageAmplifier30 (R29_U_VoltageAmplifier_1xFPGA1_U_VoltageAmplifier30.2)
V_OUT61: VoltageHeaders (P_O_1.22), U_VoltageAmplifier_1xFPGA1/U_VoltageAmplifier31 (R27_U_VoltageAmplifier_1xFPGA1_U_VoltageAmplifier31.2)
V_OUT62: VoltageHeaders (P_O_1.24), U_VoltageAmplifier_1xFPGA1/U_VoltageAmplifier31 (R29_U_VoltageAmplifier_1xFPGA1_U_VoltageAmplifier31.2)
V_OUT63: VoltageHeaders (P_O_1.27), U_VoltageAmplifier_1xFPGA1/U_VoltageAmplifier32 (R27_U_VoltageAmplifier_1xFPGA1_U_VoltageAmplifier32.2)
V_OUT64: VoltageHeaders (P_O_1.25), U_VoltageAmplifier_1xFPGA1/U_VoltageAmplifier32 (R29_U_VoltageAmplifier_1xFPGA1_U_VoltageAmplifier32.2)
V_OUT65: VoltageHeaders (P_O_1.26), U_VoltageAmplifier_1xFPGA1/U_VoltageAmplifier33 (R27_U_VoltageAmplifier_1xFPGA1_U_VoltageAmplifier33.2)
V_OUT66: VoltageHeaders (P_O_1.28), U_VoltageAmplifier_1xFPGA1/U_VoltageAmplifier33 (R29_U_VoltageAmplifier_1xFPGA1_U_VoltageAmplifier33.2)
V_OUT67: VoltageHeaders (P_O_1.31), U_VoltageAmplifier_1xFPGA1/U_VoltageAmplifier34 (R27_U_VoltageAmplifier_1xFPGA1_U_VoltageAmplifier34.2)
V_OUT68: VoltageHeaders (P_O_1.29), U_VoltageAmplifier_1xFPGA1/U_VoltageAmplifier34 (R29_U_VoltageAmplifier_1xFPGA1_U_VoltageAmplifier34.2)
V_OUT69: VoltageHeaders (P_O_1.30), U_VoltageAmplifier_1xFPGA1/U_VoltageAmplifier35 (R27_U_VoltageAmplifier_1xFPGA1_U_VoltageAmplifier35.2)
V_OUT70: VoltageHeaders (P_O_1.32), U_VoltageAmplifier_1xFPGA1/U_VoltageAmplifier35 (R29_U_VoltageAmplifier_1xFPGA1_U_VoltageAmplifier35.2)
V_OUT71: VoltageHeaders (P_O_1.35), U_VoltageAmplifier_1xFPGA1/U_VoltageAmplifier36 (R27_U_VoltageAmplifier_1xFPGA1_U_VoltageAmplifier36.2)
V_OUT72: VoltageHeaders (P_O_1.33), U_VoltageAmplifier_1xFPGA1/U_VoltageAmplifier36 (R29_U_VoltageAmplifier_1xFPGA1_U_VoltageAmplifier36.2)
V_OUT73: VoltageHeaders (P_O_1.34), U_VoltageAmplifier_1xFPGA1/U_VoltageAmplifier37 (R27_U_VoltageAmplifier_1xFPGA1_U_VoltageAmplifier37.2)
V_OUT74: VoltageHeaders (P_O_1.36), U_VoltageAmplifier_1xFPGA1/U_VoltageAmplifier37 (R29_U_VoltageAmplifier_1xFPGA1_U_VoltageAmplifier37.2)
V_OUT75: VoltageHeaders (P_O_1.37), U_VoltageAmplifier_1xFPGA1/U_VoltageAmplifier38 (R27_U_VoltageAmplifier_1xFPGA1_U_VoltageAmplifier38.2)
V_OUT84: VoltageHeaders (P_E_2.10), U_VoltageAmplifier_1xFPGA2/U_VoltageAmplifier5 (R27_U_VoltageAmplifier_1xFPGA2_U_VoltageAmplifier5.2)
V_OUT100: VoltageHeaders (P_E_2.26), U_VoltageAmplifier_1xFPGA2/U_VoltageAmplifier13 (R27_U_VoltageAmplifier_1xFPGA2_U_VoltageAmplifier13.2)
V_OUT101: VoltageHeaders (P_E_2.28), U_VoltageAmplifier_1xFPGA2/U_VoltageAmplifier13 (R29_U_VoltageAmplifier_1xFPGA2_U_VoltageAmplifier13.2)
V_OUT102: VoltageHeaders (P_E_2.27), U_VoltageAmplifier_1xFPGA2/U_VoltageAmplifier14 (R27_U_VoltageAmplifier_1xFPGA2_U_VoltageAmplifier14.2)
V_OUT103: VoltageHeaders (P_E_2.25), U_VoltageAmplifier_1xFPGA2/U_VoltageAmplifier14 (R29_U_VoltageAmplifier_1xFPGA2_U_VoltageAmplifier14.2)
V_OUT104: VoltageHeaders (P_E_2.30), U_VoltageAmplifier_1xFPGA2/U_VoltageAmplifier15 (R27_U_VoltageAmplifier_1xFPGA2_U_VoltageAmplifier15.2)
V_OUT105: VoltageHeaders (P_E_2.32), U_VoltageAmplifier_1xFPGA2/U_VoltageAmplifier15 (R29_U_VoltageAmplifier_1xFPGA2_U_VoltageAmplifier15.2)
V_OUT106: VoltageHeaders (P_E_2.31), U_VoltageAmplifier_1xFPGA2/U_VoltageAmplifier16 (R27_U_VoltageAmplifier_1xFPGA2_U_VoltageAmplifier16.2)
V_OUT107: VoltageHeaders (P_E_2.29), U_VoltageAmplifier_1xFPGA2/U_VoltageAmplifier16 (R29_U_VoltageAmplifier_1xFPGA2_U_VoltageAmplifier16.2)
V_OUT108: VoltageHeaders (P_E_2.34), U_VoltageAmplifier_1xFPGA2/U_VoltageAmplifier17 (R27_U_VoltageAmplifier_1xFPGA2_U_VoltageAmplifier17.2)
V_OUT109: VoltageHeaders (P_E_2.36), U_VoltageAmplifier_1xFPGA2/U_VoltageAmplifier17 (R29_U_VoltageAmplifier_1xFPGA2_U_VoltageAmplifier17.2)
V_OUT110: VoltageHeaders (P_E_2.35), U_VoltageAmplifier_1xFPGA2/U_VoltageAmplifier18 (R27_U_VoltageAmplifier_1xFPGA2_U_VoltageAmplifier18.2)
V_OUT111: VoltageHeaders (P_E_2.33), U_VoltageAmplifier_1xFPGA2/U_VoltageAmplifier18 (R29_U_VoltageAmplifier_1xFPGA2_U_VoltageAmplifier18.2)
V_OUT112: VoltageHeaders (P_E_2.38), U_VoltageAmplifier_1xFPGA2/U_VoltageAmplifier19 (R27_U_VoltageAmplifier_1xFPGA2_U_VoltageAmplifier19.2)
V_OUT113: VoltageHeaders (P_E_2.37), U_VoltageAmplifier_1xFPGA2/U_VoltageAmplifier19 (R29_U_VoltageAmplifier_1xFPGA2_U_VoltageAmplifier19.2)
V_OUT114: VoltageHeaders (P_O_2.3), U_VoltageAmplifier_1xFPGA2/U_VoltageAmplifier20 (R27_U_VoltageAmplifier_1xFPGA2_U_VoltageAmplifier20.2)
V_OUT115: VoltageHeaders (P_O_2.1), U_VoltageAmplifier_1xFPGA2/U_VoltageAmplifier20 (R29_U_VoltageAmplifier_1xFPGA2_U_VoltageAmplifier20.2)
V_OUT116: VoltageHeaders (P_O_2.2), U_VoltageAmplifier_1xFPGA2/U_VoltageAmplifier21 (R27_U_VoltageAmplifier_1xFPGA2_U_VoltageAmplifier21.2)
V_OUT117: VoltageHeaders (P_O_2.4), U_VoltageAmplifier_1xFPGA2/U_VoltageAmplifier21 (R29_U_VoltageAmplifier_1xFPGA2_U_VoltageAmplifier21.2)
V_OUT118: VoltageHeaders (P_O_2.7), U_VoltageAmplifier_1xFPGA2/U_VoltageAmplifier22 (R27_U_VoltageAmplifier_1xFPGA2_U_VoltageAmplifier22.2)
V_OUT119: VoltageHeaders (P_O_2.5), U_VoltageAmplifier_1xFPGA2/U_VoltageAmplifier22 (R29_U_VoltageAmplifier_1xFPGA2_U_VoltageAmplifier22.2)
V_OUT120: VoltageHeaders (P_O_2.6), U_VoltageAmplifier_1xFPGA2/U_VoltageAmplifier23 (R27_U_VoltageAmplifier_1xFPGA2_U_VoltageAmplifier23.2)
V_OUT121: VoltageHeaders (P_O_2.8), U_VoltageAmplifier_1xFPGA2/U_VoltageAmplifier23 (R29_U_VoltageAmplifier_1xFPGA2_U_VoltageAmplifier23.2)
V_OUT122: VoltageHeaders (P_O_2.11), U_VoltageAmplifier_1xFPGA2/U_VoltageAmplifier24 (R27_U_VoltageAmplifier_1xFPGA2_U_VoltageAmplifier24.2)
V_OUT123: VoltageHeaders (P_O_2.9), U_VoltageAmplifier_1xFPGA2/U_VoltageAmplifier24 (R29_U_VoltageAmplifier_1xFPGA2_U_VoltageAmplifier24.2)
V_OUT124: VoltageHeaders (P_O_2.10), U_VoltageAmplifier_1xFPGA2/U_VoltageAmplifier25 (R27_U_VoltageAmplifier_1xFPGA2_U_VoltageAmplifier25.2)
V_OUT125: VoltageHeaders (P_O_2.12), U_VoltageAmplifier_1xFPGA2/U_VoltageAmplifier25 (R29_U_VoltageAmplifier_1xFPGA2_U_VoltageAmplifier25.2)
V_OUT126: VoltageHeaders (P_O_2.15), U_VoltageAmplifier_1xFPGA2/U_VoltageAmplifier26 (R27_U_VoltageAmplifier_1xFPGA2_U_VoltageAmplifier26.2)
V_OUT127: VoltageHeaders (P_O_2.13), U_VoltageAmplifier_1xFPGA2/U_VoltageAmplifier26 (R29_U_VoltageAmplifier_1xFPGA2_U_VoltageAmplifier26.2)
V_OUT128: VoltageHeaders (P_O_2.14), U_VoltageAmplifier_1xFPGA2/U_VoltageAmplifier27 (R27_U_VoltageAmplifier_1xFPGA2_U_VoltageAmplifier27.2)
V_OUT129: VoltageHeaders (P_O_2.16), U_VoltageAmplifier_1xFPGA2/U_VoltageAmplifier27 (R29_U_VoltageAmplifier_1xFPGA2_U_VoltageAmplifier27.2)
V_OUT130: VoltageHeaders (P_O_2.19), U_VoltageAmplifier_1xFPGA2/U_VoltageAmplifier28 (R27_U_VoltageAmplifier_1xFPGA2_U_VoltageAmplifier28.2)
V_OUT131: VoltageHeaders (P_O_2.17), U_VoltageAmplifier_1xFPGA2/U_VoltageAmplifier28 (R29_U_VoltageAmplifier_1xFPGA2_U_VoltageAmplifier28.2)
V_OUT132: VoltageHeaders (P_O_2.18), U_VoltageAmplifier_1xFPGA2/U_VoltageAmplifier29 (R27_U_VoltageAmplifier_1xFPGA2_U_VoltageAmplifier29.2)
V_OUT133: VoltageHeaders (P_O_2.20), U_VoltageAmplifier_1xFPGA2/U_VoltageAmplifier29 (R29_U_VoltageAmplifier_1xFPGA2_U_VoltageAmplifier29.2)
V_OUT134: VoltageHeaders (P_O_2.23), U_VoltageAmplifier_1xFPGA2/U_VoltageAmplifier30 (R27_U_VoltageAmplifier_1xFPGA2_U_VoltageAmplifier30.2)
V_OUT135: VoltageHeaders (P_O_2.21), U_VoltageAmplifier_1xFPGA2/U_VoltageAmplifier30 (R29_U_VoltageAmplifier_1xFPGA2_U_VoltageAmplifier30.2)
V_OUT136: VoltageHeaders (P_O_2.22), U_VoltageAmplifier_1xFPGA2/U_VoltageAmplifier31 (R27_U_VoltageAmplifier_1xFPGA2_U_VoltageAmplifier31.2)
V_OUT137: VoltageHeaders (P_O_2.24), U_VoltageAmplifier_1xFPGA2/U_VoltageAmplifier31 (R29_U_VoltageAmplifier_1xFPGA2_U_VoltageAmplifier31.2)
V_OUT138: VoltageHeaders (P_O_2.27), U_VoltageAmplifier_1xFPGA2/U_VoltageAmplifier32 (R27_U_VoltageAmplifier_1xFPGA2_U_VoltageAmplifier32.2)
V_OUT139: VoltageHeaders (P_O_2.25), U_VoltageAmplifier_1xFPGA2/U_VoltageAmplifier32 (R29_U_VoltageAmplifier_1xFPGA2_U_VoltageAmplifier32.2)
V_OUT140: VoltageHeaders (P_O_2.26), U_VoltageAmplifier_1xFPGA2/U_VoltageAmplifier33 (R27_U_VoltageAmplifier_1xFPGA2_U_VoltageAmplifier33.2)
V_OUT141: VoltageHeaders (P_O_2.28), U_VoltageAmplifier_1xFPGA2/U_VoltageAmplifier33 (R29_U_VoltageAmplifier_1xFPGA2_U_VoltageAmplifier33.2)
V_OUT142: VoltageHeaders (P_O_2.31), U_VoltageAmplifier_1xFPGA2/U_VoltageAmplifier34 (R27_U_VoltageAmplifier_1xFPGA2_U_VoltageAmplifier34.2)
V_OUT143: VoltageHeaders (P_O_2.29), U_VoltageAmplifier_1xFPGA2/U_VoltageAmplifier34 (R29_U_VoltageAmplifier_1xFPGA2_U_VoltageAmplifier34.2)
V_OUT144: VoltageHeaders (P_O_2.30), U_VoltageAmplifier_1xFPGA2/U_VoltageAmplifier35 (R27_U_VoltageAmplifier_1xFPGA2_U_VoltageAmplifier35.2)
V_OUT145: VoltageHeaders (P_O_2.32), U_VoltageAmplifier_1xFPGA2/U_VoltageAmplifier35 (R29_U_VoltageAmplifier_1xFPGA2_U_VoltageAmplifier35.2)
V_OUT146: VoltageHeaders (P_O_2.35), U_VoltageAmplifier_1xFPGA2/U_VoltageAmplifier36 (R27_U_VoltageAmplifier_1xFPGA2_U_VoltageAmplifier36.2)
V_OUT147: VoltageHeaders (P_O_2.33), U_VoltageAmplifier_1xFPGA2/U_VoltageAmplifier36 (R29_U_VoltageAmplifier_1xFPGA2_U_VoltageAmplifier36.2)
V_OUT148: VoltageHeaders (P_O_2.34), U_VoltageAmplifier_1xFPGA2/U_VoltageAmplifier37 (R27_U_VoltageAmplifier_1xFPGA2_U_VoltageAmplifier37.2)
V_OUT149: VoltageHeaders (P_O_2.36), U_VoltageAmplifier_1xFPGA2/U_VoltageAmplifier37 (R29_U_VoltageAmplifier_1xFPGA2_U_VoltageAmplifier37.2)
V_OUT150: VoltageHeaders (P_O_2.37), U_VoltageAmplifier_1xFPGA2/U_VoltageAmplifier38 (R27_U_VoltageAmplifier_1xFPGA2_U_VoltageAmplifier38.2)
V_OUT152: VoltageHeaders (P_E_3.4), U_VoltageAmplifier_1xFPGA3/U_VoltageAmplifier1 (R29_U_VoltageAmplifier_1xFPGA3_U_VoltageAmplifier1.2)
V_OUT153: VoltageHeaders (P_E_3.3), U_VoltageAmplifier_1xFPGA3/U_VoltageAmplifier2 (R27_U_VoltageAmplifier_1xFPGA3_U_VoltageAmplifier2.2)
V_OUT154: VoltageHeaders (P_E_3.1), U_VoltageAmplifier_1xFPGA3/U_VoltageAmplifier2 (R29_U_VoltageAmplifier_1xFPGA3_U_VoltageAmplifier2.2)
V_OUT155: VoltageHeaders (P_E_3.6), U_VoltageAmplifier_1xFPGA3/U_VoltageAmplifier3 (R27_U_VoltageAmplifier_1xFPGA3_U_VoltageAmplifier3.2)
V_OUT156: VoltageHeaders (P_E_3.8), U_VoltageAmplifier_1xFPGA3/U_VoltageAmplifier3 (R29_U_VoltageAmplifier_1xFPGA3_U_VoltageAmplifier3.2)
V_OUT157: VoltageHeaders (P_E_3.7), U_VoltageAmplifier_1xFPGA3/U_VoltageAmplifier4 (R27_U_VoltageAmplifier_1xFPGA3_U_VoltageAmplifier4.2)
V_OUT158: VoltageHeaders (P_E_3.5), U_VoltageAmplifier_1xFPGA3/U_VoltageAmplifier4 (R29_U_VoltageAmplifier_1xFPGA3_U_VoltageAmplifier4.2)
V_OUT159: VoltageHeaders (P_E_3.10), U_VoltageAmplifier_1xFPGA3/U_VoltageAmplifier5 (R27_U_VoltageAmplifier_1xFPGA3_U_VoltageAmplifier5.2)
V_OUT167: VoltageHeaders (P_E_3.18), U_VoltageAmplifier_1xFPGA3/U_VoltageAmplifier9 (R27_U_VoltageAmplifier_1xFPGA3_U_VoltageAmplifier9.2)
V_OUT168: VoltageHeaders (P_E_3.20), U_VoltageAmplifier_1xFPGA3/U_VoltageAmplifier9 (R29_U_VoltageAmplifier_1xFPGA3_U_VoltageAmplifier9.2)
V_OUT169: VoltageHeaders (P_E_3.19), U_VoltageAmplifier_1xFPGA3/U_VoltageAmplifier10 (R27_U_VoltageAmplifier_1xFPGA3_U_VoltageAmplifier10.2)
V_OUT170: VoltageHeaders (P_E_3.17), U_VoltageAmplifier_1xFPGA3/U_VoltageAmplifier10 (R29_U_VoltageAmplifier_1xFPGA3_U_VoltageAmplifier10.2)
V_OUT171: VoltageHeaders (P_E_3.22), U_VoltageAmplifier_1xFPGA3/U_VoltageAmplifier11 (R27_U_VoltageAmplifier_1xFPGA3_U_VoltageAmplifier11.2)
V_OUT172: VoltageHeaders (P_E_3.24), U_VoltageAmplifier_1xFPGA3/U_VoltageAmplifier11 (R29_U_VoltageAmplifier_1xFPGA3_U_VoltageAmplifier11.2)
V_OUT173: VoltageHeaders (P_E_3.23), U_VoltageAmplifier_1xFPGA3/U_VoltageAmplifier12 (R27_U_VoltageAmplifier_1xFPGA3_U_VoltageAmplifier12.2)
V_OUT174: VoltageHeaders (P_E_3.21), U_VoltageAmplifier_1xFPGA3/U_VoltageAmplifier12 (R29_U_VoltageAmplifier_1xFPGA3_U_VoltageAmplifier12.2)
V_OUT175: VoltageHeaders (P_E_3.26), U_VoltageAmplifier_1xFPGA3/U_VoltageAmplifier13 (R27_U_VoltageAmplifier_1xFPGA3_U_VoltageAmplifier13.2)
V_OUT176: VoltageHeaders (P_E_3.28), U_VoltageAmplifier_1xFPGA3/U_VoltageAmplifier13 (R29_U_VoltageAmplifier_1xFPGA3_U_VoltageAmplifier13.2)
V_OUT177: VoltageHeaders (P_E_3.27), U_VoltageAmplifier_1xFPGA3/U_VoltageAmplifier14 (R27_U_VoltageAmplifier_1xFPGA3_U_VoltageAmplifier14.2)
V_OUT178: VoltageHeaders (P_E_3.25), U_VoltageAmplifier_1xFPGA3/U_VoltageAmplifier14 (R29_U_VoltageAmplifier_1xFPGA3_U_VoltageAmplifier14.2)
V_OUT179: VoltageHeaders (P_E_3.30), U_VoltageAmplifier_1xFPGA3/U_VoltageAmplifier15 (R27_U_VoltageAmplifier_1xFPGA3_U_VoltageAmplifier15.2)
V_OUT180: VoltageHeaders (P_E_3.32), U_VoltageAmplifier_1xFPGA3/U_VoltageAmplifier15 (R29_U_VoltageAmplifier_1xFPGA3_U_VoltageAmplifier15.2)
V_OUT181: VoltageHeaders (P_E_3.31), U_VoltageAmplifier_1xFPGA3/U_VoltageAmplifier16 (R27_U_VoltageAmplifier_1xFPGA3_U_VoltageAmplifier16.2)
V_OUT182: VoltageHeaders (P_E_3.29), U_VoltageAmplifier_1xFPGA3/U_VoltageAmplifier16 (R29_U_VoltageAmplifier_1xFPGA3_U_VoltageAmplifier16.2)
V_OUT183: VoltageHeaders (P_E_3.34), U_VoltageAmplifier_1xFPGA3/U_VoltageAmplifier17 (R27_U_VoltageAmplifier_1xFPGA3_U_VoltageAmplifier17.2)
V_OUT184: VoltageHeaders (P_E_3.36), U_VoltageAmplifier_1xFPGA3/U_VoltageAmplifier17 (R29_U_VoltageAmplifier_1xFPGA3_U_VoltageAmplifier17.2)
V_OUT185: VoltageHeaders (P_E_3.35), U_VoltageAmplifier_1xFPGA3/U_VoltageAmplifier18 (R27_U_VoltageAmplifier_1xFPGA3_U_VoltageAmplifier18.2)
V_OUT186: VoltageHeaders (P_E_3.33), U_VoltageAmplifier_1xFPGA3/U_VoltageAmplifier18 (R29_U_VoltageAmplifier_1xFPGA3_U_VoltageAmplifier18.2)
V_OUT187: VoltageHeaders (P_E_3.38), U_VoltageAmplifier_1xFPGA3/U_VoltageAmplifier19 (R27_U_VoltageAmplifier_1xFPGA3_U_VoltageAmplifier19.2)
V_OUT188: VoltageHeaders (P_E_3.37), U_VoltageAmplifier_1xFPGA3/U_VoltageAmplifier19 (R29_U_VoltageAmplifier_1xFPGA3_U_VoltageAmplifier19.2)
V_OUT189: VoltageHeaders (P_O_3.3), U_VoltageAmplifier_1xFPGA3/U_VoltageAmplifier20 (R27_U_VoltageAmplifier_1xFPGA3_U_VoltageAmplifier20.2)
V_OUT190: VoltageHeaders (P_O_3.1), U_VoltageAmplifier_1xFPGA3/U_VoltageAmplifier20 (R29_U_VoltageAmplifier_1xFPGA3_U_VoltageAmplifier20.2)
V_OUT191: VoltageHeaders (P_O_3.2), U_VoltageAmplifier_1xFPGA3/U_VoltageAmplifier21 (R27_U_VoltageAmplifier_1xFPGA3_U_VoltageAmplifier21.2)
V_OUT192: VoltageHeaders (P_O_3.4), U_VoltageAmplifier_1xFPGA3/U_VoltageAmplifier21 (R29_U_VoltageAmplifier_1xFPGA3_U_VoltageAmplifier21.2)
V_OUT193: VoltageHeaders (P_O_3.7), U_VoltageAmplifier_1xFPGA3/U_VoltageAmplifier22 (R27_U_VoltageAmplifier_1xFPGA3_U_VoltageAmplifier22.2)
V_OUT194: VoltageHeaders (P_O_3.5), U_VoltageAmplifier_1xFPGA3/U_VoltageAmplifier22 (R29_U_VoltageAmplifier_1xFPGA3_U_VoltageAmplifier22.2)
V_OUT195: VoltageHeaders (P_O_3.6), U_VoltageAmplifier_1xFPGA3/U_VoltageAmplifier23 (R27_U_VoltageAmplifier_1xFPGA3_U_VoltageAmplifier23.2)
V_OUT196: VoltageHeaders (P_O_3.8), U_VoltageAmplifier_1xFPGA3/U_VoltageAmplifier23 (R29_U_VoltageAmplifier_1xFPGA3_U_VoltageAmplifier23.2)
V_OUT197: VoltageHeaders (P_O_3.11), U_VoltageAmplifier_1xFPGA3/U_VoltageAmplifier24 (R27_U_VoltageAmplifier_1xFPGA3_U_VoltageAmplifier24.2)
V_OUT198: VoltageHeaders (P_O_3.9), U_VoltageAmplifier_1xFPGA3/U_VoltageAmplifier24 (R29_U_VoltageAmplifier_1xFPGA3_U_VoltageAmplifier24.2)
V_OUT199: VoltageHeaders (P_O_3.10), U_VoltageAmplifier_1xFPGA3/U_VoltageAmplifier25 (R27_U_VoltageAmplifier_1xFPGA3_U_VoltageAmplifier25.2)
V_OUT200: VoltageHeaders (P_O_3.12), U_VoltageAmplifier_1xFPGA3/U_VoltageAmplifier25 (R29_U_VoltageAmplifier_1xFPGA3_U_VoltageAmplifier25.2)
V_OUT201: VoltageHeaders (P_O_3.15), U_VoltageAmplifier_1xFPGA3/U_VoltageAmplifier26 (R27_U_VoltageAmplifier_1xFPGA3_U_VoltageAmplifier26.2)
V_OUT202: VoltageHeaders (P_O_3.13), U_VoltageAmplifier_1xFPGA3/U_VoltageAmplifier26 (R29_U_VoltageAmplifier_1xFPGA3_U_VoltageAmplifier26.2)
V_OUT203: VoltageHeaders (P_O_3.14), U_VoltageAmplifier_1xFPGA3/U_VoltageAmplifier27 (R27_U_VoltageAmplifier_1xFPGA3_U_VoltageAmplifier27.2)
V_OUT204: VoltageHeaders (P_O_3.16), U_VoltageAmplifier_1xFPGA3/U_VoltageAmplifier27 (R29_U_VoltageAmplifier_1xFPGA3_U_VoltageAmplifier27.2)
V_OUT205: VoltageHeaders (P_O_3.19), U_VoltageAmplifier_1xFPGA3/U_VoltageAmplifier28 (R27_U_VoltageAmplifier_1xFPGA3_U_VoltageAmplifier28.2)
V_OUT206: VoltageHeaders (P_O_3.17), U_VoltageAmplifier_1xFPGA3/U_VoltageAmplifier28 (R29_U_VoltageAmplifier_1xFPGA3_U_VoltageAmplifier28.2)
V_OUT207: VoltageHeaders (P_O_3.18), U_VoltageAmplifier_1xFPGA3/U_VoltageAmplifier29 (R27_U_VoltageAmplifier_1xFPGA3_U_VoltageAmplifier29.2)
V_OUT208: VoltageHeaders (P_O_3.20), U_VoltageAmplifier_1xFPGA3/U_VoltageAmplifier29 (R29_U_VoltageAmplifier_1xFPGA3_U_VoltageAmplifier29.2)
V_OUT209: VoltageHeaders (P_O_3.23), U_VoltageAmplifier_1xFPGA3/U_VoltageAmplifier30 (R27_U_VoltageAmplifier_1xFPGA3_U_VoltageAmplifier30.2)
V_OUT210: VoltageHeaders (P_O_3.21), U_VoltageAmplifier_1xFPGA3/U_VoltageAmplifier30 (R29_U_VoltageAmplifier_1xFPGA3_U_VoltageAmplifier30.2)
V_OUT211: VoltageHeaders (P_O_3.22), U_VoltageAmplifier_1xFPGA3/U_VoltageAmplifier31 (R27_U_VoltageAmplifier_1xFPGA3_U_VoltageAmplifier31.2)
V_OUT212: VoltageHeaders (P_O_3.24), U_VoltageAmplifier_1xFPGA3/U_VoltageAmplifier31 (R29_U_VoltageAmplifier_1xFPGA3_U_VoltageAmplifier31.2)
V_OUT213: VoltageHeaders (P_O_3.27), U_VoltageAmplifier_1xFPGA3/U_VoltageAmplifier32 (R27_U_VoltageAmplifier_1xFPGA3_U_VoltageAmplifier32.2)
V_OUT214: VoltageHeaders (P_O_3.25), U_VoltageAmplifier_1xFPGA3/U_VoltageAmplifier32 (R29_U_VoltageAmplifier_1xFPGA3_U_VoltageAmplifier32.2)
V_OUT215: VoltageHeaders (P_O_3.26), U_VoltageAmplifier_1xFPGA3/U_VoltageAmplifier33 (R27_U_VoltageAmplifier_1xFPGA3_U_VoltageAmplifier33.2)
V_OUT216: VoltageHeaders (P_O_3.28), U_VoltageAmplifier_1xFPGA3/U_VoltageAmplifier33 (R29_U_VoltageAmplifier_1xFPGA3_U_VoltageAmplifier33.2)
V_OUT217: VoltageHeaders (P_O_3.31), U_VoltageAmplifier_1xFPGA3/U_VoltageAmplifier34 (R27_U_VoltageAmplifier_1xFPGA3_U_VoltageAmplifier34.2)
V_OUT218: VoltageHeaders (P_O_3.29), U_VoltageAmplifier_1xFPGA3/U_VoltageAmplifier34 (R29_U_VoltageAmplifier_1xFPGA3_U_VoltageAmplifier34.2)
V_OUT219: VoltageHeaders (P_O_3.30), U_VoltageAmplifier_1xFPGA3/U_VoltageAmplifier35 (R27_U_VoltageAmplifier_1xFPGA3_U_VoltageAmplifier35.2)
V_OUT220: VoltageHeaders (P_O_3.32), U_VoltageAmplifier_1xFPGA3/U_VoltageAmplifier35 (R29_U_VoltageAmplifier_1xFPGA3_U_VoltageAmplifier35.2)
V_OUT221: VoltageHeaders (P_O_3.35), U_VoltageAmplifier_1xFPGA3/U_VoltageAmplifier36 (R27_U_VoltageAmplifier_1xFPGA3_U_VoltageAmplifier36.2)
V_OUT222: VoltageHeaders (P_O_3.33), U_VoltageAmplifier_1xFPGA3/U_VoltageAmplifier36 (R29_U_VoltageAmplifier_1xFPGA3_U_VoltageAmplifier36.2)
V_OUT223: VoltageHeaders (P_O_3.34), U_VoltageAmplifier_1xFPGA3/U_VoltageAmplifier37 (R27_U_VoltageAmplifier_1xFPGA3_U_VoltageAmplifier37.2)
V_OUT224: VoltageHeaders (P_O_3.36), U_VoltageAmplifier_1xFPGA3/U_VoltageAmplifier37 (R29_U_VoltageAmplifier_1xFPGA3_U_VoltageAmplifier37.2)
V_OUT225: VoltageHeaders (P_O_3.37), U_VoltageAmplifier_1xFPGA3/U_VoltageAmplifier38 (R27_U_VoltageAmplifier_1xFPGA3_U_VoltageAmplifier38.2)
V_OUT228: VoltageHeaders (P_E_4.3), U_VoltageAmplifier_1xFPGA4/U_VoltageAmplifier2 (R27_U_VoltageAmplifier_1xFPGA4_U_VoltageAmplifier2.2)
V_OUT229: VoltageHeaders (P_E_4.1), U_VoltageAmplifier_1xFPGA4/U_VoltageAmplifier2 (R29_U_VoltageAmplifier_1xFPGA4_U_VoltageAmplifier2.2)